# EAGLE schematic Full System (EAGLE 8.6.3)
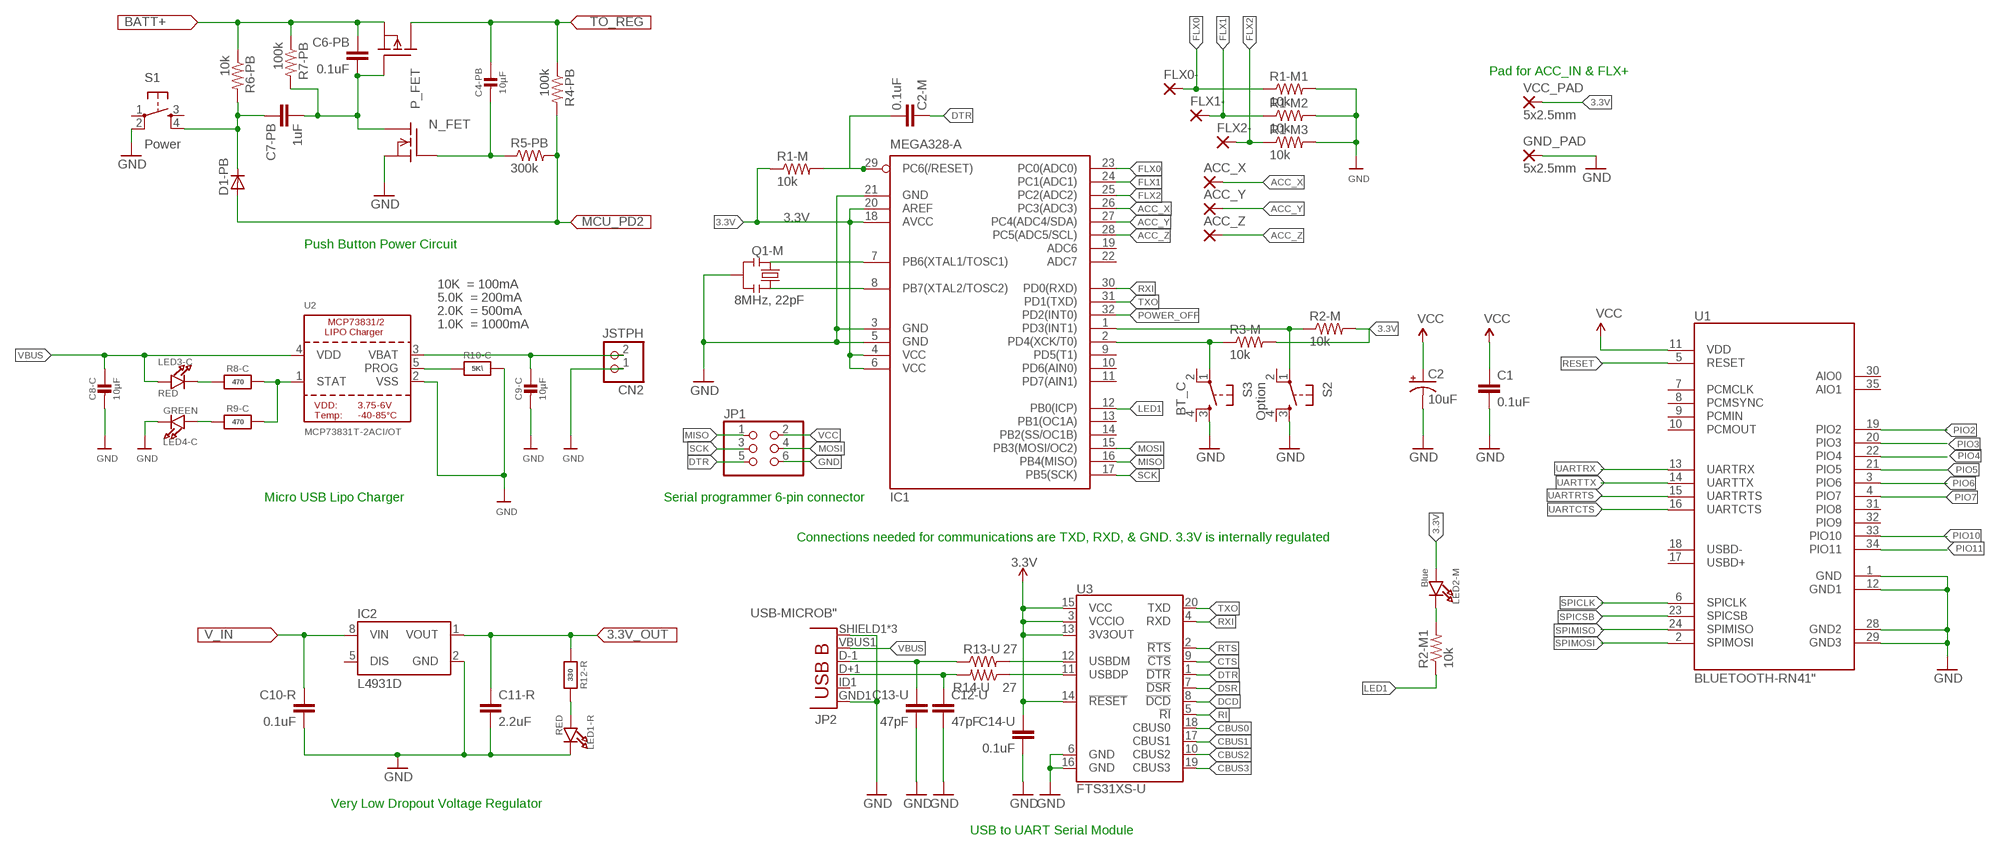
[diagram p0: schematic, sheet 1]

## Parts
ACC_X  1,6/0,8  [1,6/0,8]
ACC_Y  1,6/0,8  [1,6/0,8]
ACC_Z  1,6/0,8  [1,6/0,8]
C1  0.1uF  CAP0603-CAP  [0603-CAP]
C2  10uF  CAP_POL1206  [EIA3216]
C2-M  0.1uF  CAP0603-CAP  [0603-CAP]
C4-PB  10µF  CAP_CERAMIC0805-NOOUTLINE  [0805-NO]
C6-PB  0.1uF  0.1UF-25V(+80/-20%)(0603)  [0603-CAP]
C7-PB  1uF  0.1UF-25V(+80/-20%)(0603)  [0603-CAP]
C8-C  10µF  CAP_CERAMIC0805-NOOUTLINE  [0805-NO]
C9-C  10µF  CAP_CERAMIC0805-NOOUTLINE  [0805-NO]
C10-R  0.1uF  0.1UF-25V(+80/-20%)(0603)  [0603-CAP]
C11-R  2.2uF  0.1UF-25V(+80/-20%)(0603)  [0603-CAP]
C12-U  47pF  47PF-50V-5%(0603)  [0603-CAP]
C13-U  47pF  47PF-50V-5%(0603)  [0603-CAP]
C14-U  0.1uF  0.1UF-25V(+80/-20%)(0603)  [0603-CAP]
CN2  JSTPH  JST_2PIN  [JSTPH2]
D1-PB  D-A1-C3  [SOT23]
FLX0-  1,6/0,8  [1,6/0,8]
FLX1-  1,6/0,8  [1,6/0,8]
FLX2-  1,6/0,8  [1,6/0,8]
GND_PAD  5x2.5mm  WIREPADSMD5-2,5  [5-2,5]
IC1  MEGA328-A  MEGA8-AI  [TQFP32-08]
IC2  L4931D  [SO08]
JP1  PINHD-2X3  [2X03]
JP2  USB-MICROB"  [USB-B-MICRO-SMD_V03]
LED1-R  RED  LED0805_NOOUTLINE  [CHIPLED_0805_NOOUTLINE]
LED2-M  Blue  LED0805_NOOUTLINE  [CHIPLED_0805_NOOUTLINE]
LED3-C  RED  LED0805_NOOUTLINE  [CHIPLED_0805_NOOUTLINE]
LED4-C  GREEN  LED0805_NOOUTLINE  [CHIPLED_0805_NOOUTLINE]
N_FET  BSS101  [TO92]
P_FET  BSS92  [TO92]
Q1-M  8MHz, 22pF  RESONATOR1:1  [RESONATOR-SMD-1:1]
R1-M  10k  R-US_R0805  [R0805]
R1-M1  10k  R-US_R0805  [R0805]
R1-M2  10k  R-US_R0805  [R0805]
R1-M3  10k  R-US_R0805  [R0805]
R2-M  10k  R-US_R0805  [R0805]
R2-M1  10k  R-US_R0805  [R0805]
R3-M  10k  R-US_R0805  [R0805]
R4-PB  100k  R-US_R0805  [R0805]
R5-PB  300k  R-US_R0805  [R0805]
R6-PB  10k  R-US_R0805  [R0805]
R7-PB  100k  R-US_R0805  [R0805]
R8-C  470  RESISTOR0805_NOOUTLINE  [0805-NO]
R9-C  470  RESISTOR0805_NOOUTLINE  [0805-NO]
R10-C  5K\  RESISTOR0805_NOOUTLINE  [0805-NO]
R12-R  330  RESISTOR0805_NOOUTLINE  [0805-NO]
R13-U  27  27OHM1/10W1%(0603)0603-RES  [0603-RES]
R14-U  27  27OHM1/10W1%(0603)0603-RES  [0603-RES]
S1  Power  TAC_SWITCHSMD  [TACTILE_SWITCH_SMD]
S2  Option  TAC_SWITCHSMD  [TACTILE_SWITCH_SMD]
S3  BT_C  TAC_SWITCHSMD  [TACTILE_SWITCH_SMD]
U1  BLUETOOTH-RN41"  [RN41]
U2  MCP73831T-2ACI/OT  MCP73831/2  [SOT23-5]
U3  FTS31XS-U  FT231XS  [SSOP20_L]
VCC_PAD  5x2.5mm  WIREPADSMD5-2,5  [5-2,5]

## Nets
3.3V [power]: C11-R.1 C14-U.1 IC1.4(VCC) IC1.6(VCC) IC1.18(AVCC) IC1.20(AREF) IC2.1(VOUT) LED2-M.A R1-M.1 R2-M.2 R3-M.2 R12-R.1 U3.3(VCCIO) U3.13(3V3OUT) U3.14(!RESET) U3.15(VCC) VCC_PAD.1(P)
ACC_X: ACC_X.1(P) IC1.26(PC3(ADC3))
ACC_Y: ACC_Y.1(P) IC1.27(PC4(ADC4/SDA))
ACC_Z: ACC_Z.1(P) IC1.28(PC5(ADC5/SCL))
CBUS0: U3.18(CBUS0)
CBUS3: U3.19(CBUS3)
CTS: U3.9(!CTS)
DCD: U3.8(!DCD)
DSR: U3.7(!DSR)
DTR: C2-M.2 JP1.5 U3.1(!DTR)
FLX0: FLX0-.1(P) IC1.23(PC0(ADC0)) R1-M1.1
FLX1: FLX1-.1(P) IC1.24(PC1(ADC1)) R1-M2.1
FLX2: FLX2-.1(P) IC1.25(PC2(ADC2)) R1-M3.1
GND: C1.2 C2.C(-) C8-C.2 C9-C.2 C10-R.2 C11-R.2 C12-U.2 C13-U.2 C14-U.2 CN2.1 GND_PAD.1(P) IC1.3(GND) IC1.5(GND) IC1.21(GND) IC2.2(GND) JP1.6 JP2.GND1(GND) JP2.SHIELD1(SHIELD) JP2.SHIELD2(SHIELD) JP2.SHIELD3(SHIELD) LED1-R.C LED4-C.C N_FET.1(S) R1-M1.2 R1-M2.2 R1-M3.2 R10-C.2 S1.2 S2.3 S3.3 U1.1(GND) U1.12(GND1) U1.28(GND2) U1.29(GND3) U2.2(VSS) U3.6(GND) U3.16(GND)
LED1 [power]: IC1.12(PB0(ICP)) R2-M1.1
MISO: IC1.16(PB4(MISO)) JP1.1
MOSI: IC1.15(PB3(MOSI/OC2)) JP1.4
N$1: R13-U.2 U3.12(USBDM)
N$2: IC1.1(PD3(INT1)) R2-M.1 S2.1
N$3: IC1.7(PB6(XTAL1/TOSC1))
N$4: IC1.8(PB7(XTAL2/TOSC2))
N$5: C7-PB.1 D1-PB.3(C) R6-PB.2 S1.4
N$6: IC1.2(PD4(XCK/T0)) R3-M.1 S3.1
N$7: LED1-R.A R12-R.2
N$9: C4-PB.2 N_FET.2(G) R5-PB.1
N$10: LED2-M.C R2-M1.2
N$11: R14-U.1 U3.11(USBDP)
N$12: C12-U.1 JP2.D+1(D+) R14-U.2
N$15: C6-PB.2 C7-PB.2 N_FET.3(D) P_FET.1(G) R7-PB.2
N$16: LED3-C.C R8-C.1
N$17: R8-C.2 R9-C.2 U2.1(STAT)
N$18: R10-C.1 U2.5(PROG)
N$19: LED4-C.A R9-C.1
N$21: C13-U.1 JP2.D-1(D-) R13-U.1
N$22: U3.17(CBUS1)
N$23: U3.10(CBUS2)
PIO2: U1.19(PIO2)
PIO3: U1.20(PIO3)
PIO4: U1.22(PIO4)
PIO5: U1.21(PIO5)
PIO6: U1.3(PIO6)
PIO7: U1.4(PIO7)
PIO10: U1.33(PIO10)
PIO11: U1.34(PIO11)
POWER_OFF [power]: D1-PB.1(A) IC1.32(PD2(INT0)) R4-PB.2 R5-PB.2
RESET: C2-M.1 IC1.29(PC6(/RESET)) R1-M.2 U1.5(RESET)
RI: U3.5(!RI)
RTS: U3.2(!RTS)
RXI: IC1.30(PD0(RXD)) U3.4(RXD)
SCK: IC1.17(PB5(SCK)) JP1.3
SPICLK: U1.6(SPICLK)
SPICSB: U1.23(SPICSB)
SPIMISO: U1.24(SPIMISO)
SPIMOSI: U1.2(SPIMOSI)
TXO: IC1.31(PD1(TXD)) U3.20(TXD)
UARTCTS: U1.16(UARTCTS)
UARTRTS: U1.15(UARTRTS)
UARTRX: U1.13(UARTRX)
UARTTX: U1.14(UARTTX)
V_IN: C4-PB.1 C10-R.1 IC2.8(VIN) P_FET.2(D) R4-PB.1
VBAT: C6-PB.1 C9-C.1 CN2.2 P_FET.3(S) R6-PB.1 R7-PB.1 U2.3(VBAT)
VBUS: C8-C.1 JP2.VBUS1(VBUS) LED3-C.A U2.4(VDD)
VCC: C1.1 C2.A(+) JP1.2 U1.11(VDD)
Unconnected: IC1.9(PD5(T1)) IC1.10(PD6(AIN0)) IC1.11(PD7(AIN1)) IC1.13(PB1(OC1A)) IC1.14(PB2(SS/OC1B)) IC1.19(ADC6) IC1.22(ADC7) IC2.5(DIS) JP2.ID1(USBID) Q1-M.1 Q1-M.2 Q1-M.3 S1.1 S1.3 S2.2 S2.4 S3.2 S3.4 U1.7(PCMCLK) U1.8(PCMSYNC) U1.9(PCMIN) U1.10(PCMOUT) U1.17(USBD+) U1.18(USBD-) U1.30(AIO0) U1.31(PIO8) U1.32(PIO9) U1.35(AIO1)

## Notes on the sheet
- Pad for ACC_IN & FLX+
- Push Button Power Circuit
- 10K  = 100mA
- 5.0K  = 200mA
- 2.0K  = 500mA
- 1.0K  = 1000mA
- Micro USB Lipo Charger | Serial programmer 6-pin connector
- Connections needed for communications are TXD, RXD, & GND. 3.3V is internally regulated
- Very Low Dropout Voltage Regulator
- USB to UART Serial Module

## Library data of the parts
ACC_X ACC_Y ACC_Z FLX0- FLX1- FLX2- = wirepad:1,6/0,8: THROUGH-HOLE PAD
C1 C2-M = SparkFun:CAP: Capacitor Standard 0603 ceramic capacitor, and 0.1" leaded capacitor.
C2 = SparkFun:CAP_POL: Capacitor Polarized These are standard SMD and PTH capacitors. Normally 10uF, 47uF, and 100uF in electrolytic and tantalum varieties. Always verify the external diameter of the through hole cap, it varies with capacity, voltage, and manufacturer. The EIA devices should be standard.
C4-PB C8-C C9-C = microbuilder:CAP_CERAMIC: Ceramic Capacitors For new designs, use the packages preceded by an '_' character since they are more reliable: The following footprints should be used on most boards: _0402 - Standard footprint for regular board layouts _0603 - Standard footprint for regular board layouts _0805 - Standard footprint for regular board layouts _1206 - Standard footprint for regular board layouts For extremely tight-pitch boards where space is at a premium, the following 'micro-pitch' footprints can be used (smaller pads, no silkscreen outline, etc.): _0402MP - Micro-pitch footprint for very dense/compact boards _0603MP - Micro-pitch footprint for very dense/compact boards _0805MP - Micro-pitch footprint for very dense/compact boards _1206MP - Micro-pitch footprint for very dense/compact boards
C6-PB C10-R C14-U = SparkFun-Capacitors:0.1UF-25V(+80/-20%)(0603): CAP-00810 Ceramic Standard decoupling cap; PROD_ID: CAP-00810
C7-PB C11-R = SparkFun-Capacitors:0.1UF-25V(+80/-20%)(0603): CAP-00810 Ceramic Standard decoupling cap; PROD_ID: CAP-00810; VALUE: 0.1uF
C12-U C13-U = SparkFun-Capacitors:47PF-50V-5%(0603): CAP-08913; PROD_ID: CAP-08913
CN2 = microbuilder:JST_2PIN: JST 2-Pin Right-Angle Connector PH-Series - 4UConnector: 17311 SH-Series - 4UConnector: 07278
D1-PB = semicon-smd-ipc:D-: DIODE unfilled
GND_PAD VCC_PAD = wirepad:WIREPAD: Wire PAD connect wire on PCB
IC1 = atmel:MEGA8: MICROCONTROLLER 8 Kbytes FLASH, 1 kbytes SRAM, 512 bytes EEPROM, USART, 6-channel 10 bit ADC, 2-channel 8 bit ADC Pin compatible with Atmega48, ATMega88, ATMega168 Source: avr.lbr; MPN: ATMEGA8-16AU; OC_FARNELL: 9171371; OC_NEWARK: 73M8863
IC2 = v-reg-3:L4931: STMicroelectronics <http://www.st.com> 250mA low dropout voltage regulator Vin 5V to 28V (transients 40V), disable pin, 50µA shutdown current
JP1 = pinhead:PINHD-2X3: PIN HEADER
JP2 = SparkFun-Connectors:USB-MICROB; PROD_ID: CONN-11752
LED1-R LED2-M LED3-C LED4-C = microbuilder:LED: LED 0603 - 0603 Surface Mount Package 2mA: Green LED - Low Power (3.9mcd, 2ma, 1.7Vf) - Digikey: 475-2709-2-ND Orange LED - Low Power (9.8mcd, 2ma, 1.8Vf) - Digikey: 475-1194-2-ND Red LED - Low Power (5mcd, 2ma, 1.8Vf) - Digikey: 475-1195-2-ND Yellow LED - Low Power (7mcd, 2ma, 1.8Vf) - Digikey: 475-1196-2-ND 5mA: Blue LED - Low Power (17mcd, 5ma, 2.9Vf) - Digikey: LNJ937W8CRACT-ND 0805 - 0805 Surface Mount Package 2mA: Red LED (8.8mcd, 2mA, 1.8Vf, Clear) - Low Power [Digikey: 475-2510-1-ND] Green LED (5mcd, 2mA, 1.8Vf, Clear) - Low Power [Digikey: 475-2730-1-ND] Yellow LED (11.3mcd, 2mA, 1.8Vf, Clear) - Low Power [Digikey: 475-2555-1-ND] 20mA: Red LED (104mcd, 20mA, Diffused) - LS R976 [Digikey: 475-1278-6-ND] Red LED (12mcd, 20mA, 2.0Vf, Clear) - APT2012EC [Digikey: 754-1128-1-ND] Green LED (15mcd, 20mA, 2.2Vf, Clear) - APT2012GC [Digikey: 754-1131-1-ND] Orange LED (160mcd, 20mA, 2.1Vf, Clear) - APT2012SECK [Digikey: 754-1130-1-ND] 1206 - 1206 Surface Mount Package Green LED (26mcd, 20mA, Diffused) - LG N971 [Digikey: 475-1407-6-ND] Red LED (15mcd, 20mA, Diffused) - LH N974 [Digikey: 475-1416-6-ND] Cree - Cree High-Power Surface Mount LEDs XPEBWT-L1-0000-00D50 - White 111lm 350mA 2.9Vf 6200K 110° XTEAWT-00-0000-00000LEE3 - White 114lm 350mA 2.85Vf 5000K 115° Everlight - Everlight 45-21 Series Surface Mount LEDs 45-21/QK2C-B2832AC2CB2/2T - Warm White 2000mcd 20mA 3.25Vf 3050K 120° 45-21/LK2C-B38452C4CB2/2T - Nuetral White 2000mcd 20mA 3.25Vf 4150K 120° 45-21/LK2C-B50634C6CB2/2T - Cold White 2200mcd 20mA 3.25Vf 5650K 120° PLCC2 Reverse Mount LS T77K-J1L2-1-0-2-R18-Z - Red 11.25mcd 2mA 1.8Vf 630nm 120° LO T77K-L1M2-24-Z - Orange 19.6mcd 2mA 1.8Vf 606nm 120° LY T77K-K2M1-26-Z - Yellow 15.7mcd 2mA 1.8Vf 587nm 120°
N_FET = transistor-fet:BSS101: N-Channel Enhancement MOSFET 200V; 0,16A; 11Ohm
P_FET = transistor-fet:BSS92: P-Channel Enhancement MOSFET -200V; -0,15A; 11Ohm
Q1-M = Testing:RESONATOR: Resonator Small SMD resonator. This is the itty bitty 10/20MHz resonators with built in caps. CSTCE10M0G55 and CSTCE20M0V53. Footprint for SMD has been used in SFE production for years, and does work okay. 1:1 is an attempt to get larger fillets on the sides so it will be easier to inspect these solders in our AOI machine. The pads have been minimized to match the actual metal under the resonator. To see this relation, it includes an image import of the bottom side of the component. Imported to scale on layer 200.
R1-M R1-M1-R1-M3 R2-M R2-M1 R3-M R4-PB R5-PB R6-PB R7-PB = rcl:R-US_: RESISTOR, American symbol; SPICEPREFIX: R
R8-C R9-C R10-C R12-R = microbuilder:RESISTOR: Resistors For new designs, use the packages preceded by an '_' character since they are more reliable: The following footprints should be used on most boards: _0402 - Standard footprint for regular board layouts _0603 - Standard footprint for regular board layouts _0805 - Standard footprint for regular board layouts _1206 - Standard footprint for regular board layouts For extremely tight-pitch boards where space is at a premium, the following 'micro-pitch' footprints can be used (smaller pads, no silkscreen outline, etc.): _0402MP - Micro-pitch footprint for very dense/compact boards _0603MP - Micro-pitch footprint for very dense/compact boards _0805MP - Micro-pitch footprint for very dense/compact boards _1206MP - Micro-pitch footprint for very dense/compact boards
R13-U R14-U = SparkFun-Resistors:27OHM1/10W1%(0603): RES-09334; PROD_ID: RES-09334
S1-S3 = Spark:TAC_SWITCH: SMD Tactiile Switch
U1 = SparkFun-RF:BLUETOOTH-RN41: Bluetooth SMD module
U2 = microbuilder:MCP73831/2: MCP73831/2 LIPO Charger VDD: 3.75 - 6V Temp -40 - 85°C Programmable Charge Rate: 15-500mA NOTE: STAT is a tri-state logic output on the MCP73831 and an open-drain output on the MCP73832. SOT23-5 with 4.2V output and tri-state logic on STAT = MCP73831T-2ACI/OT
U3 = SparkFun-DigitalIC:FT231X: FTDI FT231X Full Speed USB to Full-handshake UART This USB2.0 Full Speed IC offers a compact bridge to full handshake UART interfaces. The device is a UART, capable of operating up to 3MBaud, with low power consumption (8mA). The FT231X includes the complete FT-X series feature set and enables USB to be added into a system design quickly and easily over a UART interface.; PROD_ID: IC-11524

## Net classes
0 default: width 0.203 mm
1 power: width 0.254 mm